# Altium project Watch.PrjPcb
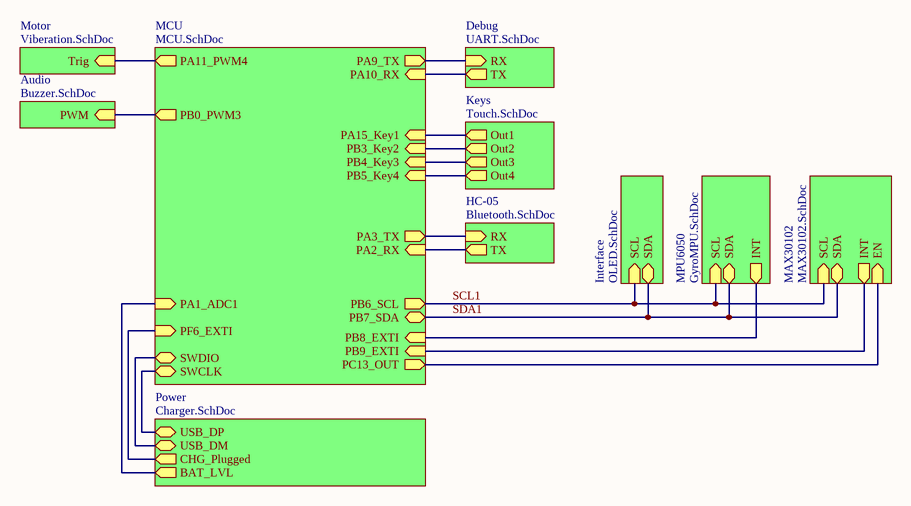
[diagram p0: main.SchDoc]
11 sheets, 81 parts. Net scope: hierarchical (ports join the sheet entries above them; power ports are global).
Board file: open-watch.PcbDoc
Sheets:
  main.SchDoc
    MCU = MCU.SchDoc
    HC-05 = Bluetooth.SchDoc
    Motor = Viberation.SchDoc
    Interface = OLED.SchDoc
    Keys = Touch.SchDoc
    Audio = Buzzer.SchDoc
    Power = Charger.SchDoc
    MPU6050 = GyroMPU.SchDoc
    Debug = UART.SchDoc
    MAX30102 = MAX30102.SchDoc

## Sheet main.SchDoc
size 209 x 148 mm

### Sub-sheets
Audio = Buzzer.SchDoc: PWM (in)
Debug = UART.SchDoc: RX (in), TX (out)
HC-05 = Bluetooth.SchDoc: RX (in), TX (out)
Interface = OLED.SchDoc: SDA (bidir), SCL (in)
Keys = Touch.SchDoc: Out4 (out), Out2 (out), Out1 (out), Out3 (out)
MAX30102 = MAX30102.SchDoc: SCL (in), INT (out), SDA (bidir), EN (in)
MCU = MCU.SchDoc: PA2_RX (in), PB7_SDA (bidir), SWDIO (bidir), SWCLK (bidir), PA9_TX (out), PA3_TX (out), PA10_RX (in), PB6_SCL (out), PA11_PWM4 (out), PA1_ADC1 (in), PF6_EXTI (in), PB4_Key3 (in), PB3_Key2 (in), PB8_EXTI (in), PA15_Key1 (in), PB5_Key4 (in), PB0_PWM3 (out), PB9_EXTI (in), PC13_OUT (out)
Motor = Viberation.SchDoc: Trig (in)
MPU6050 = GyroMPU.SchDoc: INT (out), SDA (bidir), SCL (in)
Power = Charger.SchDoc: CHG_Plugged (out), USB_DP (bidir), BAT_LVL (out), USB_DM (bidir)

### Nets
SCL1: sheet MCU/PB6_SCL, sheet Interface/SCL, sheet MPU6050/SCL, sheet MAX30102/SCL
SDA1: sheet MCU/PB7_SDA, sheet Interface/SDA, sheet MPU6050/SDA, sheet MAX30102/SDA
SWCLK: sheet MCU/SWCLK, sheet Power/USB_DP
SWDIO: sheet MCU/SWDIO, sheet Power/USB_DM
NetBT1_1: sheet MCU/PA2_RX, sheet HC-05/TX
NetBT1_2: sheet MCU/PA3_TX, sheet HC-05/RX
NetC29_1: sheet MCU/PA1_ADC1, sheet Power/BAT_LVL
NetC33_1: sheet MCU/PB9_EXTI, sheet MAX30102/INT
NetM1_1: sheet MCU/PA11_PWM4, sheet Motor/Trig
NetM2_1: sheet MCU/PB0_PWM3, sheet Audio/PWM
NetR11_1: sheet MCU/PF6_EXTI, sheet Power/CHG_Plugged
NetR17_1: sheet MCU/PA9_TX, sheet Debug/RX
NetR18_1: sheet MCU/PA10_RX, sheet Debug/TX
NetU1_2: sheet MCU/PC13_OUT, sheet MAX30102/EN
NetU1_38: sheet MCU/PA15_Key1, sheet Keys/Out1
NetU1_39: sheet MCU/PB3_Key2, sheet Keys/Out2
NetU1_40: sheet MCU/PB4_Key3, sheet Keys/Out3
NetU1_41: sheet MCU/PB5_Key4, sheet Keys/Out4
NetU1_45: sheet MCU/PB8_EXTI, sheet MPU6050/INT

## Sheet MCU.SchDoc
size A4
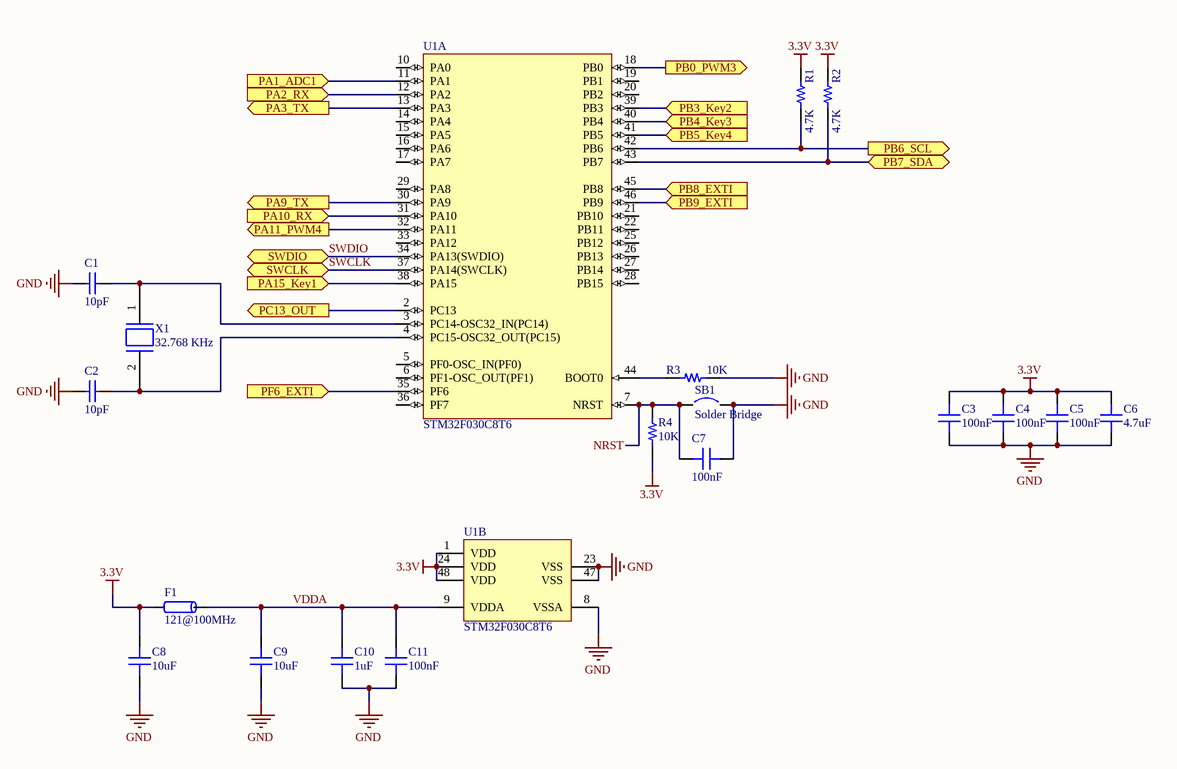
[diagram p1: MCU.SchDoc]

### Parts
C1  10pF  [0603C]
C2  10pF  [0603C]
C3  100nF  [CAP 0603_1608]
C4  100nF  [CAP 0603_1608]
C5  100nF  [CAP 0603_1608]
C6  4.7uF  [CAP 0603_1608]
C7  100nF  [CAP 0603_1608]
C8  10uF  [CAP 0603_1608]
C9  10uF  [CAP 0603_1608]
C10  1uF  [CAP 0603_1608]
C11  100nF  [CAP 0603_1608]
F1  121@100MHz  [Ferrite-0805]
R1  4.7K  [RES 0603_1608]
R2  4.7K  [RES 0603_1608]
R3  10K  [RES 0603_1608]
R4  10K  [RES 0603_1608]
SB1  Solder Bridge  [Solder Bridge]
U1  STM32F030C8T6  [LQFP-48 7x7MM P0.5MM]  (parts A,B of 2)
X1  32.768 KHz  [32.768 - Right]

### Ports
PA1_ADC1 (in), PA2_RX (in), PA3_TX (out), PA9_TX (out), PA10_RX (in), PA11_PWM4 (out), PA15_Key1 (in), PB0_PWM3 (out), PB3_Key2 (in), PB4_Key3 (in), PB5_Key4 (in), PB6_SCL (out), PB7_SDA (bidir), PB8_EXTI (in), PB9_EXTI (in), PC13_OUT (out), PF6_EXTI (in), SWCLK (bidir), SWDIO (bidir)

### Nets
3.3V: C3.2 C4.2 C5.2 C6.2 C8.2 F1.1 R1.2 R2.2 R4.1 U1.1(VDD) U1.24(VDD) U1.48(VDD)
GND: C1.1 C2.1 C3.1 C4.1 C5.1 C6.1 C7.1 C8.1 C9.1 C10.1 C11.1 R3.2 SB1.2 U1.8(VSSA) U1.23(VSS) U1.47(VSS)
NRST: C7.2 R4.2 SB1.1 U1.7(NRST)
SCL1: R1.1 U1.42(PB6) ; port PB6_SCL
SDA1: R2.1 U1.43(PB7) ; port PB7_SDA
SWCLK: U1.37(PA14(SWCLK)) ; port SWCLK
SWDIO: U1.34(PA13(SWDIO)) ; port SWDIO
VDDA: C9.2 C10.2 C11.2 F1.2 U1.9(VDDA)
NetBT1_1: U1.12(PA2) ; port PA2_RX
NetBT1_2: U1.13(PA3) ; port PA3_TX
NetC1_2: C1.2 U1.3(PC14-OSC32_IN(PC14)) X1.1
NetC2_2: C2.2 U1.4(PC15-OSC32_OUT(PC15)) X1.2
NetC29_1: U1.11(PA1) ; port PA1_ADC1
NetC33_1: U1.46(PB9) ; port PB9_EXTI
NetM1_1: U1.32(PA11) ; port PA11_PWM4
NetM2_1: U1.18(PB0) ; port PB0_PWM3
NetR3_1: R3.1 U1.44(BOOT0)
NetR11_1: U1.35(PF6) ; port PF6_EXTI
NetR17_1: U1.30(PA9) ; port PA9_TX
NetR18_1: U1.31(PA10) ; port PA10_RX
NetU1_2: U1.2(PC13) ; port PC13_OUT
NetU1_38: U1.38(PA15) ; port PA15_Key1
NetU1_39: U1.39(PB3) ; port PB3_Key2
NetU1_40: U1.40(PB4) ; port PB4_Key3
NetU1_41: U1.41(PB5) ; port PB5_Key4
NetU1_45: U1.45(PB8) ; port PB8_EXTI

Not connected (* = marked no-connect by the designer): U1 5(PF0-OSC_IN(PF0)) 6(PF1-OSC_OUT(PF1)) 10(PA0) 14(PA4) 15(PA5) 16(PA6) 17(PA7) 19(PB1) 20(PB2) 21(PB10) 22(PB11) 25(PB12) 26(PB13) 27(PB14) 28(PB15) 29(PA8) 33(PA12) 36(PF7)

### Library data of the parts
C1 C2 = Cap: Capacitor; Value: 10pF
C3-C11 = Cap 0603: SMT Capacitor
  C3-C5 C7 C11: VALUE: 100nF
  C6: VALUE: 4.7uF
  C8 C9: VALUE: 10uF
  C10: VALUE: 1uF
F1 = Ferrite Bead
R1-R4 = Res 0603: SMT Resistor
  R1 R2: VALUE: 4.7K
  R3 R4: VALUE: 10K
U1 = STM32F030C8T6: ARM Cortex-M0 32-bit MCU, 64 KB Flash, 8 KB Internal RAM, 39 I/Os, 48-pin LQFP, -40 to 85 degC, Tray; FLASH Size (Prog) (kB): 64; I/Os (High Current): 39; Internal RAM Size (kB): 8; Operating Frequency(F) (Processor speed) (MHz): 48; Supply Voltage(Vcc) min (V): 2.4; DatasheetVersion: Rev. 1; PackageVersion: Rev. 6, 06/2013; PackageReference: LQFP48; PackageDescription: 48-Pin Low Profile Quad Flat Package, 7 x 7 mm Body, 0.5 mm Pitch; Supplier 1: Digi-Key; Supplier Part Number 1: 497-14043-ND; Supplier 2: Newark; Supplier Part Number 2: 06X3647; Supplier 3: Mouser; Supplier Part Number 3: 511-STM32F030C8T6; Core: ARM Cortex-M0; Packing: Tray; Mounting Technology: Surface Mount; PartNumber: STM32F030C8T6; ComponentLink1Description: Manufacturer URL; ComponentLink1URL: http://www.st.com/web/en/home.html; ComponentLink2Description: Datasheet; ComponentLink2URL: http://www.st.com/st-web-ui/static/active/en/resource/technical/document/datasheet/DM00088500.pdf; ComponentLink3Description: Package Specification; ComponentLink3URL: http://www.st.com/st-web-ui/static/active/en/resource/technical/document/datasheet/DM00058181.pdf
X1 = XTAL: Frequency: 32.768 KHz

## Sheet Bluetooth.SchDoc
size 209 x 148 mm
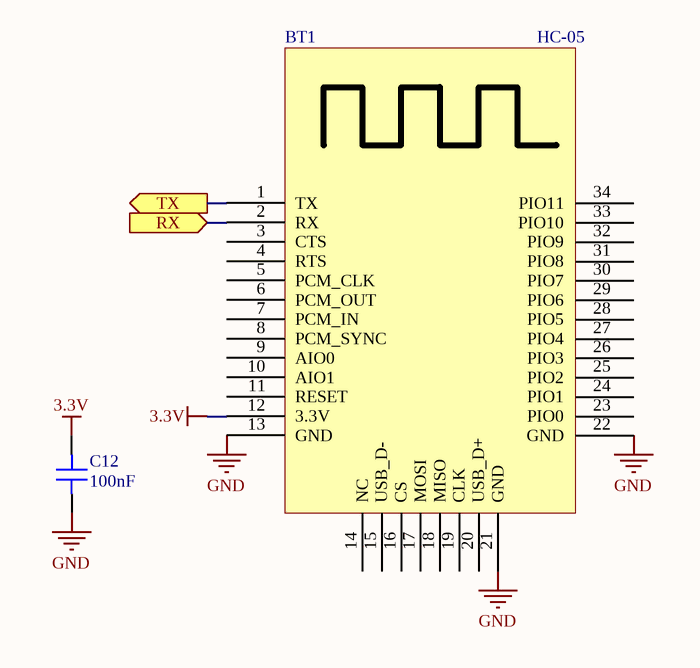
[diagram p2: Bluetooth.SchDoc]

### Parts
BT1  HC-05  [HC-05]
C12  100nF  [CAP 0603_1608]

### Ports
RX (in), TX (out)

### Nets
3.3V: BT1.12(3.3V) C12.2
GND: BT1.13(GND) BT1.21(GND) BT1.22(GND) C12.1
NetBT1_1: BT1.1(TX) ; port TX
NetBT1_2: BT1.2(RX) ; port RX

Not connected (* = marked no-connect by the designer): BT1 3(CTS) 4(RTS) 5(PCM_CLK) 6(PCM_OUT) 7(PCM_IN) 8(PCM_SYNC) 9(AIO0) 10(AIO1) 11(RESET) 14(NC) 15(USB_D-) 16(CS) 17(MOSI) 18(MISO) 19(CLK) 20(USB_D+) 23(PIO0) 24(PIO1) 25(PIO2) 26(PIO3) 27(PIO4) 28(PIO5) 29(PIO6) 30(PIO7) 31(PIO8) 32(PIO9) 33(PIO10) 34(PIO11)

### Library data of the parts
C12 = Cap 0603: SMT Capacitor; VALUE: 100nF

## Sheet Viberation.SchDoc
size 209 x 148 mm
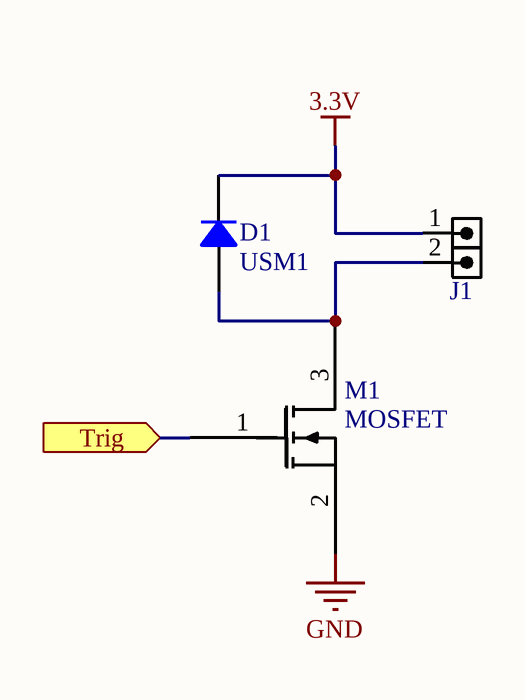
[diagram p3: Viberation.SchDoc]

### Parts
D1  USM1  [DO-214AC SMA]
J1  HDR2  [HDR1SE_M_1X2]  (value not drawn)
M1  MOSFET  [SOT-23]

### Ports
Trig (in)

### Nets
3.3V: D1.2 J1.1
GND: M1.2
NetD1_1: D1.1 J1.2 M1.3
NetM1_1: M1.1 ; port Trig

### Library data of the parts
D1 = US1M (SMD SMA): Diode Standard 1000V 1A Surface Mount SMA; PartNumber: US1M-13-F
J1 = HDRTST_1X2: HEADER, 1mm pitch, test, SMD; VALUE: HDR2
M1 = 2N7002A

## Sheet OLED.SchDoc
size 209 x 148 mm
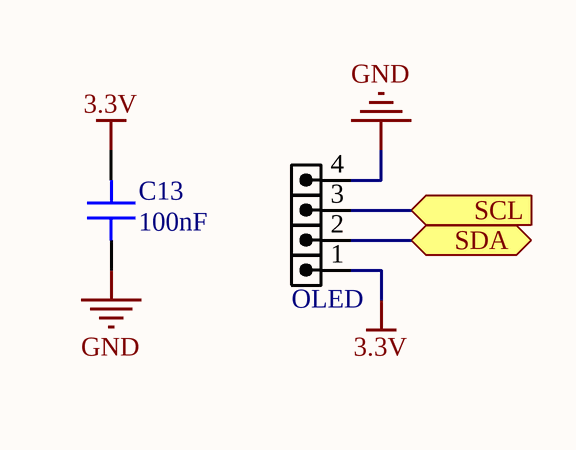
[diagram p4: OLED.SchDoc]

### Parts
C13  100nF  [CAP 0603_1608]
OLED  HDR4  [HDR1SE_M_1X4]  (value not drawn)

### Ports
SCL (in), SDA (bidir)

### Nets
3.3V: C13.2 OLED.1
GND: C13.1 OLED.4
SCL1: OLED.3 ; port SCL
SDA1: OLED.2 ; port SDA

### Library data of the parts
C13 = Cap 0603: SMT Capacitor; VALUE: 100nF
OLED = HDRTST_1X4: HEADER, 1mm pitch, test, SMD; VALUE: HDR4

## Sheet Touch.SchDoc
size 209 x 148 mm
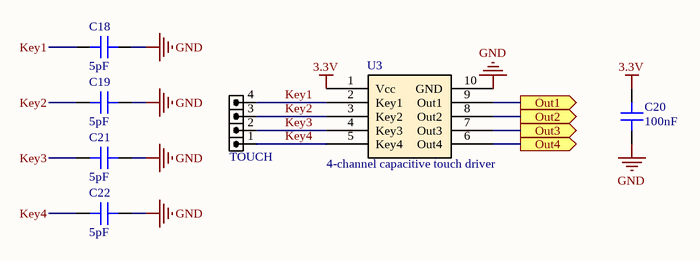
[diagram p5: Touch.SchDoc]

### Parts
C18  5pF  [CAP 0603_1608]
C19  5pF  [CAP 0603_1608]
C20  100nF  [CAP 0603_1608]
C21  5pF  [CAP 0603_1608]
C22  5pF  [CAP 0603_1608]
TOUCH  HDR4  [HDR1SE_M_1X4]  (value not drawn)
U3  4-channel capacitive touch driver  [MSOP-10]

### Ports
Out1 (out), Out2 (out), Out3 (out), Out4 (out)

### Nets
3.3V: C20.2 U3.1(Vcc)
GND: C18.2 C19.2 C20.1 C21.2 C22.2 U3.10(GND)
Key1: C18.1 TOUCH.4 U3.2(Key1)
Key2: C19.1 TOUCH.3 U3.3(Key2)
Key3: C21.1 TOUCH.2 U3.4(Key3)
Key4: C22.1 TOUCH.1 U3.5(Key4)
NetU1_38: U3.9(Out1) ; port Out1
NetU1_39: U3.8(Out2) ; port Out2
NetU1_40: U3.7(Out3) ; port Out3
NetU1_41: U3.6(Out4) ; port Out4

### Library data of the parts
C18-C22 = Cap 0603: SMT Capacitor
  C18 C19 C21 C22: VALUE: 5pF
  C20: VALUE: 100nF
TOUCH = HDRTST_1X4: HEADER, 1mm pitch, test, SMD; VALUE: HDR4
U3 = BS814A-1

## Sheet Buzzer.SchDoc
size 209 x 148 mm
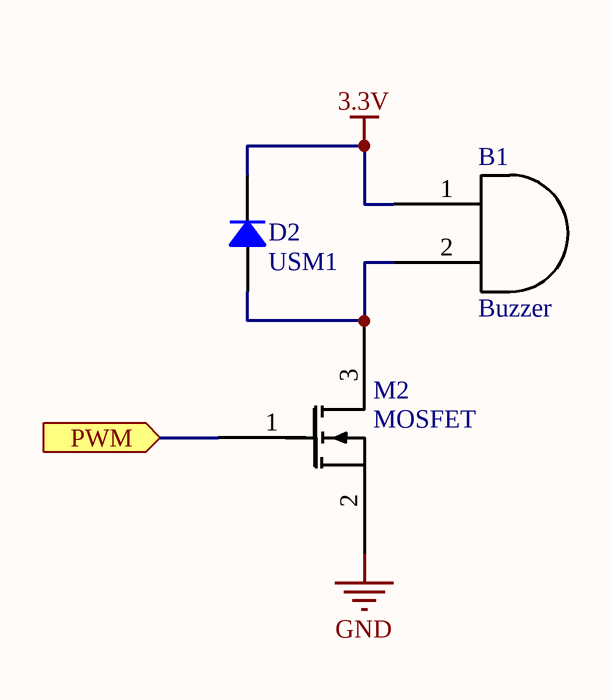
[diagram p6: Buzzer.SchDoc]

### Parts
B1  Buzzer  [Buzzer-5050]
D2  USM1  [DO-214AC SMA]
M2  MOSFET  [SOT-23]

### Ports
PWM (in)

### Nets
3.3V: B1.1 D2.2
GND: M2.2
NetB1_2: B1.2 D2.1 M2.3
NetM2_1: M2.1 ; port PWM

### Library data of the parts
D2 = US1M (SMD SMA): as D1 on sheet Viberation
M2 = 2N7002A

## Sheet Charger.SchDoc
size A4
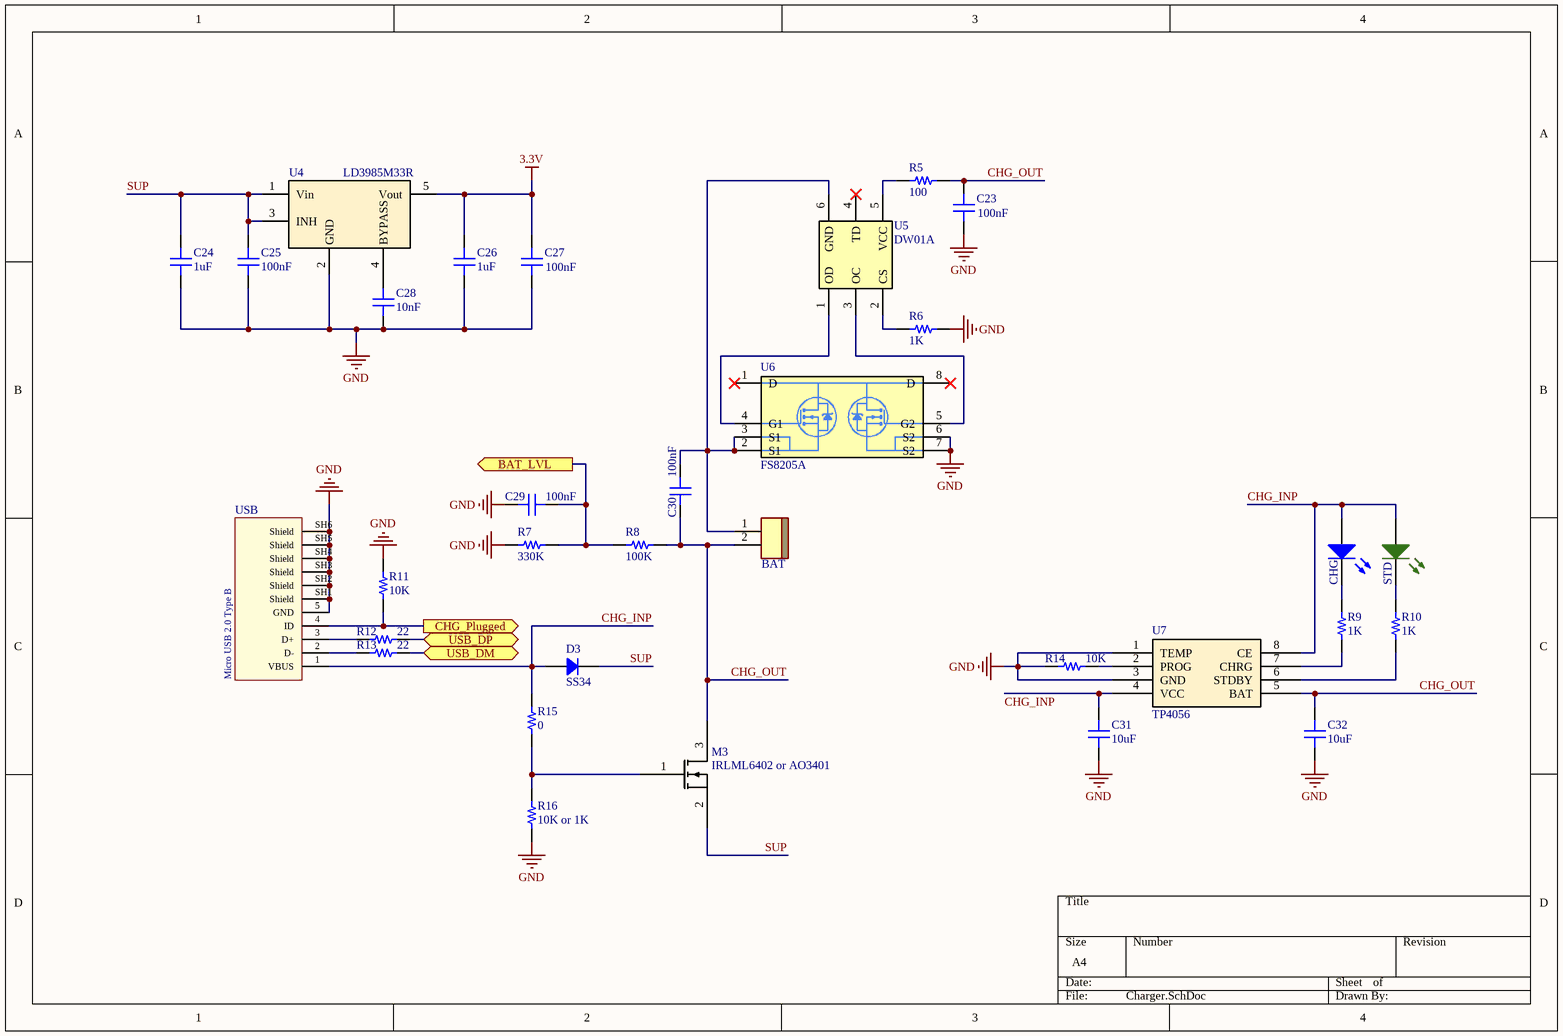
[diagram p7: Charger.SchDoc]

### Parts
BAT  JST BxB-PH-K 2Pin  [JST B2B-PH-K]  (value not drawn)
C23  100nF  [CAP 0603_1608]
C24  1uF  [CAP 0603_1608]
C25  100nF  [CAP 0603_1608]
C26  1uF  [CAP 0603_1608]
C27  100nF  [CAP 0603_1608]
C28  10nF  [CAP 0603_1608]
C29  100nF  [CAP 0603_1608]
C30  100nF  [CAP 0603_1608]
C31  10uF  [CAP 0603_1608]
C32  10uF  [CAP 0603_1608]
CHG  LED SMD 0603 BLUE  [LED_0603_RED]  (value not drawn)
D3  SS34  [DO-214AC SMA]
M3  IRLML6402 or AO3401  [SOT-23]
R5  100  [RES 0603_1608]
R6  1K  [RES 0603_1608]
R7  330K  [RES 0402_1005]
R8  100K  [RES 0402_1005]
R9  1K  [RES 0603_1608]
R10  1K  [RES 0603_1608]
R11  10K  [RES 0603_1608]
R12  22  [RES 0402_1005]
R13  22  [RES 0402_1005]
R14  10K  [RES 0603_1608]
R15  0  [RES 0603_1608]
R16  10K or 1K  [RES 0603_1608]
STD  LED SMD 0603 GREEN  [LED_0603_GREEN]  (value not drawn)
U4  LD3985M33R  [SOT23-5L]
U5  DW01A  [SOT-23-6pin]
U6  FS8205A  [TTSOP-8]
U7  TP4056  [SOIC-8]
USB  Micro USB 2.0 Type B  [USB_MICRO_B_BM_SHT]

### Ports
BAT_LVL (out), CHG_Plugged (out), USB_DM (bidir), USB_DP (bidir)

### Nets
3.3V: C26.2 C27.2 U4.5(Vout)
GND: C23.1 C24.1 C25.1 C26.1 C27.1 C28.1 C29.2 C31.2 C32.2 R6.1 R7.1 R11.2 R14.1 R16.1 U4.2(GND) U6.6(S2) U6.7(S2) U7.1(TEMP) U7.3(GND) USB.5(GND) USB.SH1(Shield) USB.SH2(Shield) USB.SH3(Shield) USB.SH4(Shield) USB.SH5(Shield) USB.SH6(Shield)
CHG_INP: C31.1 CHG.1(A) D3.1 R15.2 STD.1(A) U7.4(VCC) U7.8(CE) USB.1(VBUS)
CHG_OUT: BAT.2 C23.2 C30.2 C32.1 M3.3 R5.2 R8.2 U7.5(BAT)
SUP: C24.2 C25.2 D3.2 M3.2 U4.1(Vin) U4.3(INH)
SWCLK: R12.2 ; port USB_DP
SWDIO: R13.2 ; port USB_DM
NetBAT_1: BAT.1 C30.1 U5.6(GND) U6.2(S1) U6.3(S1)
NetC28_2: C28.2 U4.4(BYPASS)
NetC29_1: C29.1 R7.2 R8.1 ; port BAT_LVL
NetCHG_2: CHG.2(K) R9.2
NetM3_1: M3.1 R15.1 R16.2
NetR5_1: R5.1 U5.5(VCC)
NetR6_2: R6.2 U5.2(CS)
NetR9_1: R9.1 U7.7(CHRG)
NetR10_1: R10.1 U7.6(STDBY)
NetR10_2: R10.2 STD.2(K)
NetR11_1: R11.1 USB.4(ID) ; port CHG_Plugged
NetR12_1: R12.1 USB.3(D+)
NetR13_1: R13.1 USB.2(D-)
NetR14_2: R14.2 U7.2(PROG)
NetU5_1: U5.1(OD) U6.4(G1)
NetU5_3: U5.3(OC) U6.5(G2)

Not connected (* = marked no-connect by the designer): U5 4(TD)*; U6 1(D)* 8(D)*

### Library data of the parts
BAT = JST BxB-PH-K 2Pin: Connector Header Through Hole 0.079" (2.00mm); PartNumber: B2B-PH-K-S(LF)(SN)
C23-C32 = Cap 0603: SMT Capacitor
  C23 C25 C27 C29 C30: VALUE: 100nF
  C24 C26: VALUE: 1uF
  C28: VALUE: 10nF
  C31 C32: VALUE: 10uF
D3 = US1M (SMD SMA): Diode Standard 1000V 1A Surface Mount SMA; PartNumber: SS34
M3 = 2N7002A: Name: IRLML6402 or AO3401
R5 R6 R9-R11 R14-R16 = Res 0603: SMT Resistor
  R5: VALUE: 100
  R6 R9 R10: VALUE: 1K
  R11 R14: VALUE: 10K
  R15: VALUE: 0
  R16: VALUE: 10K or 1K
R7 R8 R12 R13 = Res 0402: SMT Resistor
  R7: VALUE: 330K
  R8: VALUE: 100K
  R12 R13: VALUE: 22
U4 = LD3985M33R: 3.3V LDO Regulatoe
USB = Micro USB 2.0 Type B Horizonta (SMD) UB-MC5BR3-SD204-4S-1-TB NMP: USB - micro B  Receptacle Connector 5 Position Surface Mount, Right Angle; PartNumber: UB-MC5BR3-SD204-4S-1-TB NMP

## Sheet GyroMPU.SchDoc
size 209 x 148 mm
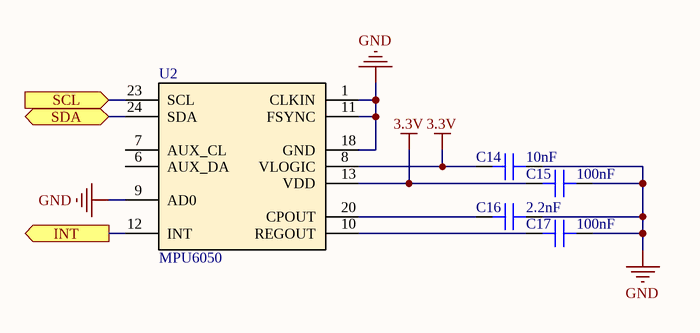
[diagram p8: GyroMPU.SchDoc]

### Parts
C14  10nF  [CAP 0603_1608]
C15  100nF  [CAP 0603_1608]
C16  2.2nF  [CAP 0603_1608]
C17  100nF  [CAP 0603_1608]
U2  MPU6050  [QFN-24TA]

### Ports
INT (out), SCL (in), SDA (bidir)

### Nets
3.3V: C14.2 C15.2 U2.8(VLOGIC) U2.13(VDD)
GND: C14.1 C15.1 C16.2 C17.2 U2.1(CLKIN) U2.9(AD0) U2.11(FSYNC) U2.18(GND)
SCL1: U2.23(SCL) ; port SCL
SDA1: U2.24(SDA) ; port SDA
NetC16_1: C16.1 U2.20(CPOUT)
NetC17_1: C17.1 U2.10(REGOUT)
NetU1_45: U2.12(INT) ; port INT

Not connected (* = marked no-connect by the designer): U2 6(AUX_DA) 7(AUX_CL)

### Library data of the parts
C14-C17 = Cap 0603: SMT Capacitor
  C14: VALUE: 10nF
  C15 C17: VALUE: 100nF
  C16: VALUE: 2.2nF

## Sheet UART.SchDoc
size A4
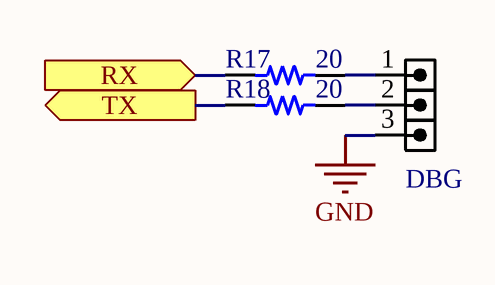
[diagram p9: UART.SchDoc]

### Parts
DBG  HDR3  [HDR1SE_M_1X3]  (value not drawn)
R17  20  [RES 0603_1608]
R18  20  [RES 0603_1608]

### Ports
RX (in), TX (out)

### Nets
GND: DBG.3
NetDBG_1: DBG.1 R17.2
NetDBG_2: DBG.2 R18.2
NetR17_1: R17.1 ; port RX
NetR18_1: R18.1 ; port TX

### Library data of the parts
DBG = HDRTST_1X3: HEADER, 1mm pitch, test, SMD; VALUE: HDR3
R17 R18 = Res 0603: SMT Resistor; VALUE: 20

## Sheet MAX30102.SchDoc
size 127 x 114 mm
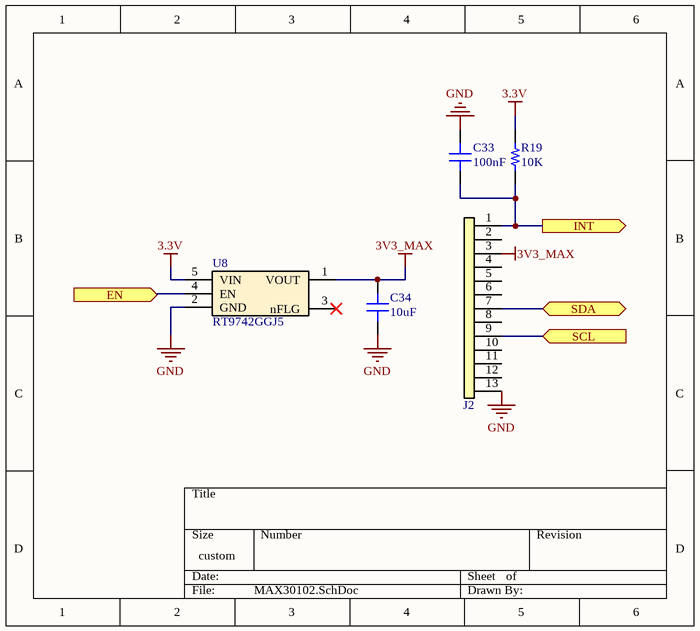
[diagram p10: MAX30102.SchDoc]

### Parts
C33  100nF  [CAP 0603_1608]
C34  10uF  [CAP 0603_1608]
J2  FPC-13pos  [FPC-0.3mm-13pos]  (value not drawn)
R19  10K  [RES 0603_1608]
U8  RT9742GGJ5  [SOT23-5L]

### Ports
EN (in), INT (out), SCL (in), SDA (bidir)

### Nets
3.3V: R19.1 U8.5(VIN)
3V3_MAX: C34.2 J2.3 U8.1(VOUT)
GND: C33.2 C34.1 J2.13 U8.2(GND)
SCL1: J2.9 ; port SCL
SDA1: J2.7 ; port SDA
NetC33_1: C33.1 J2.1 R19.2 ; port INT
NetU1_2: U8.4(EN) ; port EN

Not connected (* = marked no-connect by the designer): J2 2 4 5 6 8 10 11 12; U8 3(nFLG)*

### Library data of the parts
C33 C34 = Cap 0603: SMT Capacitor
  C33: VALUE: 100nF
  C34: VALUE: 10uF
J2 = FPC-13pos: FPC 0.3mm pitch 13pos
R19 = Res 0603: SMT Resistor; VALUE: 10K

## Nets that join several sheets
3.3V: MCU (12 pins), Bluetooth (BT1.12 C12.2), Viberation (D1.2 J1.1), OLED (C13.2 OLED.1), Touch (C20.2 U3.1), Buzzer (B1.1 D2.2), Charger (C26.2 C27.2 U4.5), GyroMPU (C14.2 C15.2 U2.8 U2.13), MAX30102 (R19.1 U8.5)
GND: MCU (16 pins), Bluetooth (BT1.13 BT1.21 BT1.22 C12.1), Viberation (M1.2), OLED (C13.1 OLED.4), Touch (6 pins), Buzzer (M2.2), Charger (26 pins), GyroMPU (8 pins), UART (DBG.3), MAX30102 (C33.2 C34.1 J2.13 U8.2)
NetBT1_1: MCU (U1.12), Bluetooth (BT1.1)
NetBT1_2: MCU (U1.13), Bluetooth (BT1.2)
NetC29_1: MCU (U1.11), Charger (C29.1 R7.2 R8.1)
NetC33_1: MCU (U1.46), MAX30102 (C33.1 J2.1 R19.2)
NetM1_1: MCU (U1.32), Viberation (M1.1)
NetM2_1: MCU (U1.18), Buzzer (M2.1)
NetR11_1: MCU (U1.35), Charger (R11.1 USB.4)
NetR17_1: MCU (U1.30), UART (R17.1)
NetR18_1: MCU (U1.31), UART (R18.1)
NetU1_2: MCU (U1.2), MAX30102 (U8.4)
NetU1_38: MCU (U1.38), Touch (U3.9)
NetU1_39: MCU (U1.39), Touch (U3.8)
NetU1_40: MCU (U1.40), Touch (U3.7)
NetU1_41: MCU (U1.41), Touch (U3.6)
NetU1_45: MCU (U1.45), GyroMPU (U2.12)
SCL1: MCU (R1.1 U1.42), OLED (OLED.3), GyroMPU (U2.23), MAX30102 (J2.9)
SDA1: MCU (R2.1 U1.43), OLED (OLED.2), GyroMPU (U2.24), MAX30102 (J2.7)
SWCLK: MCU (U1.37), Charger (R12.2)
SWDIO: MCU (U1.34), Charger (R13.2)